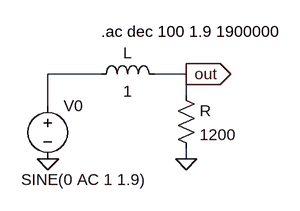
[diagram p0: schematic RL.asc]
RL.asc, the LTspice schematic file:
Version 4
SHEET 1 880 680
WIRE 176 96 96 96
WIRE 304 96 256 96
WIRE 304 128 304 96
WIRE 96 144 96 96
WIRE 304 224 304 208
FLAG 96 224 0
FLAG 304 224 0
FLAG 304 96 out
IOPIN 304 96 Out
SYMBOL voltage 96 128 R0
WINDOW 123 0 0 Left 0
WINDOW 39 0 0 Left 0
WINDOW 3 -40 127 Left 2
SYMATTR InstName V0
SYMATTR Value SINE(0 AC 1 1.9)
SYMBOL ind 160 112 R270
WINDOW 0 32 56 VTop 2
WINDOW 3 5 56 VBottom 2
SYMATTR InstName L
SYMATTR Value 1
SYMBOL res 288 112 R0
SYMATTR InstName R
SYMATTR Value 1200
TEXT 176 32 Left 2 !.ac dec 100 1.9 1900000

The netlist it stands for:
* RL.asc
V0 N001 0 SINE(0 AC 1 1.9)
L N001 out 1
R out 0 1200
.ac dec 100 1.9 1900000
.backanno
.end